# EAGLE design IOTERM (EAGLE 6.5.0)
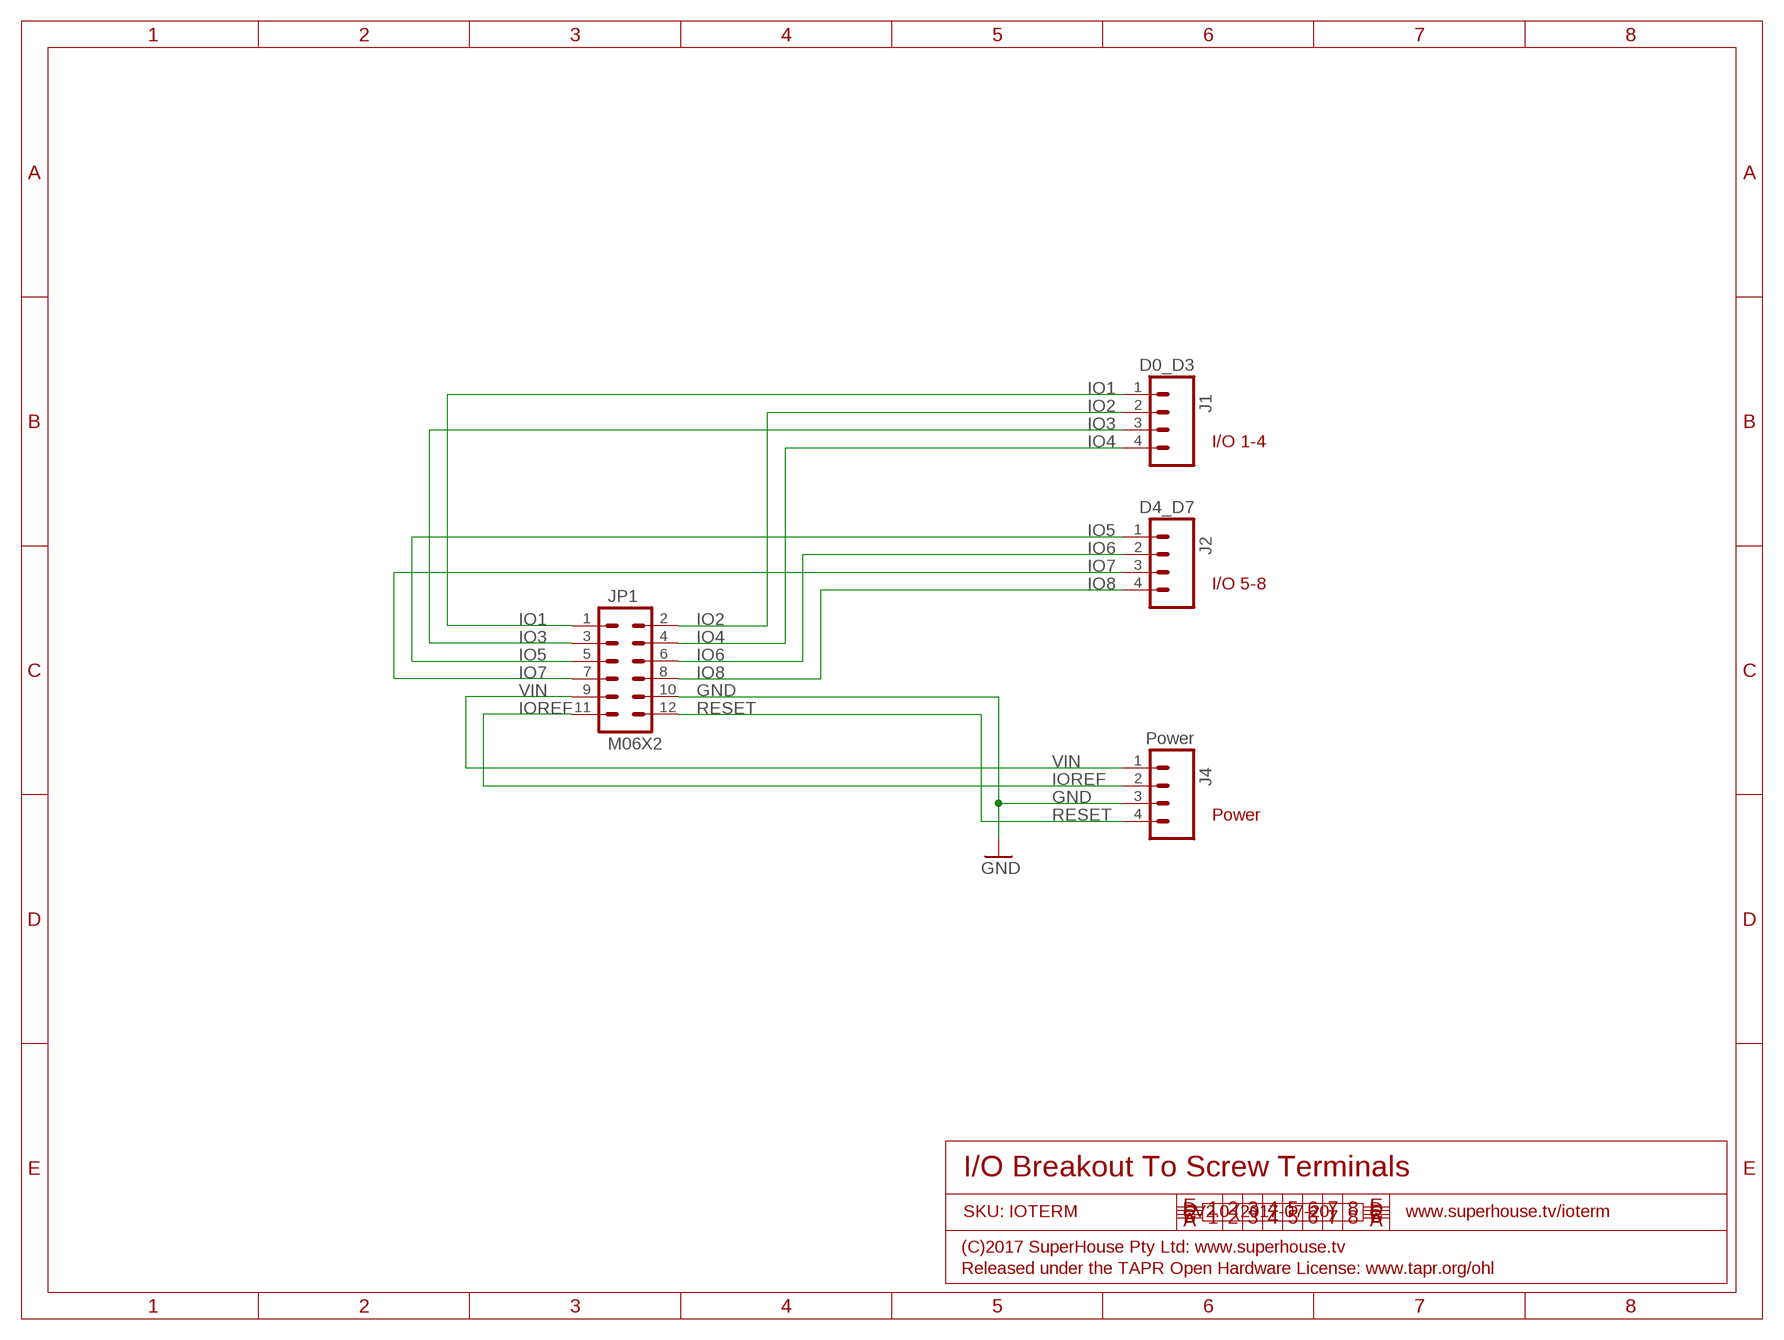
[diagram p0: schematic, sheet 1]

## Parts
J1  D0_D3  M04SCREW  [SCREWTERMINAL-3.5MM-4]
J2  D4_D7  M04SCREW  [SCREWTERMINAL-3.5MM-4]
J4  Power  M04SCREW  [SCREWTERMINAL-3.5MM-4]
JP1  M06X2  [2X6-SHROUDED]

## Nets
GND: J4.3 JP1.10
IO1: J1.1 JP1.1
IO2: J1.2 JP1.2
IO3: J1.3 JP1.3
IO4: J1.4 JP1.4
IO5: J2.1 JP1.5
IO6: J2.2 JP1.6
IO7: J2.3 JP1.7
IO8: J2.4 JP1.8
IOREF: J4.2 JP1.11
RESET: J4.4 JP1.12
VIN: J4.1 JP1.9

## Notes on the sheet
- I/O 1-4
- I/O 5-8
- Power
- I/O Breakout To Screw Terminals
- SKU: IOTERM | V2.0 (2017-07-20) | www.superhouse.tv/ioterm
- (C)2017 SuperHouse Pty Ltd: www.superhouse.tv
- Released under the TAPR Open Hardware License: www.tapr.org/ohl

## Library data of the parts
J1 J2 J4 = freetronics-master-v1.1:M04: Header 4 Standard 4-pin 0.1" header. Use with straight break away headers (SKU : PRT-00116), right angle break away headers (PRT-00553), swiss pins (PRT-00743), machine pins (PRT-00117), and female headers (PRT-00115). Molex polarized connector foot print use with SKU : PRT-08231 with associated crimp pins and housings.
JP1 = freetronics-jon:M06X2

## Board
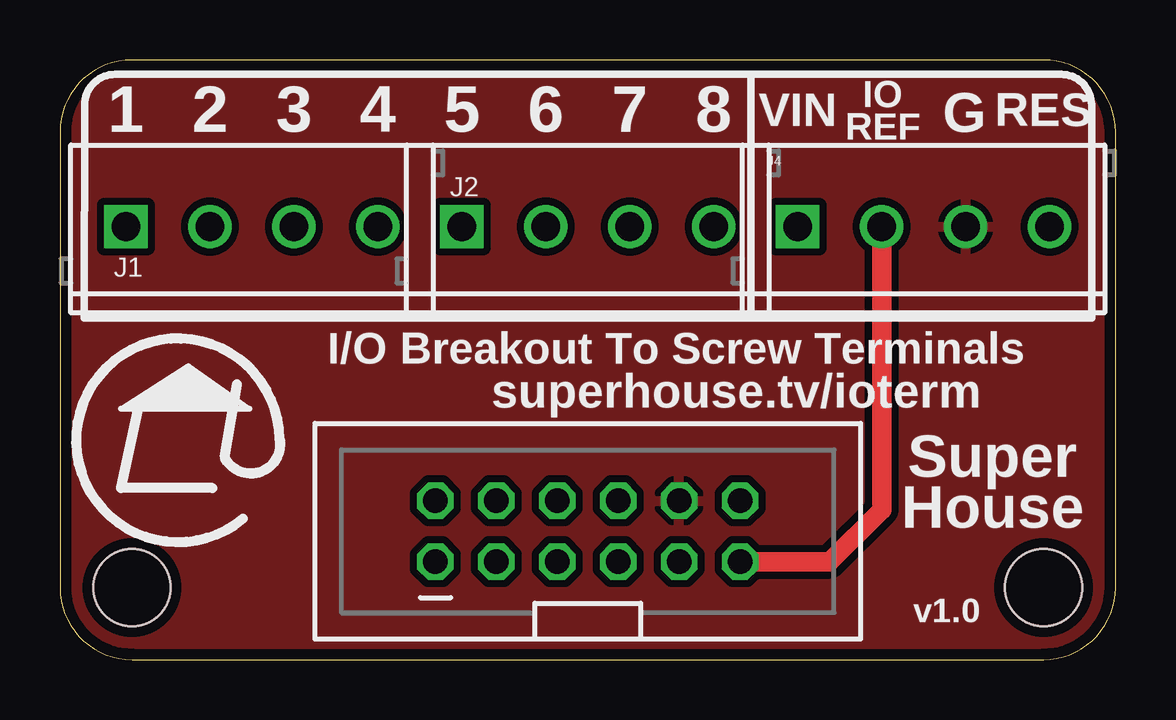
[diagram p1: board, top side]
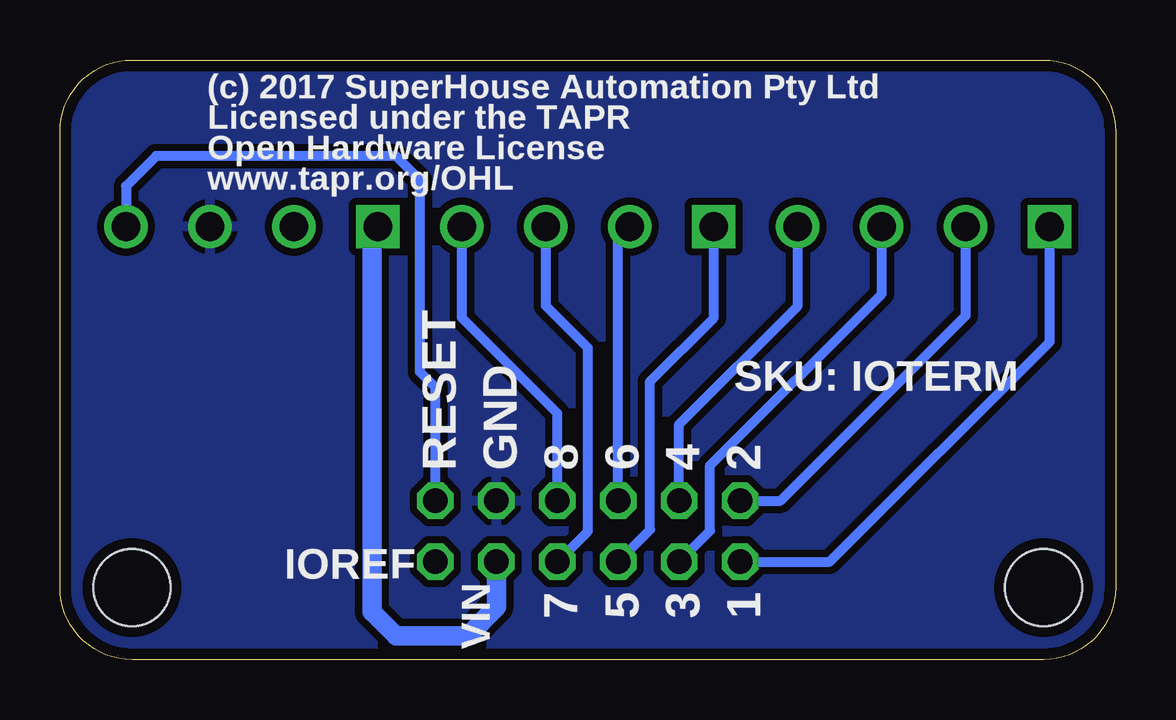
[diagram p2: board, bottom side, seen from below]

Size 44 x 25 mm. Coordinates in mm from the lower left corner, seen from the top.
Outline: 0,3 arc90 3,0 41,0 arc90 44,3 44,22 arc90 41,25 3,25 arc90 0,22 0,3
Copper layers (1*16): Top 0.035mm / dielectric 1.5mm / Bottom 0.035mm
Design rules "default *": minimum track width 10mil, minimum drill 24mil, track to track 12mil, track to pad 12mil, pad to pad 12mil, via to via 12mil, smd to smd 8mil, copper to edge 18mil, drill to drill 8mil, minimum pad ring 10mil, minimum via ring 8mil, stop-mask expansion 4mil, vias tented up to drill 25mil, thermal gap 10mil
Holes 3.2 mm at 41,3 3,3

### Footprints (pad centres in the part's own frame; a part is rotated, then mirrored left to right if it is on the bottom)
SCREWTERMINAL-3.5MM-4 = drill 1.2 square: 1 0,0 | drill 1.2: 2 3.5,0; 3 7,0; 4 10.5,0
2X6-SHROUDED = drill 1.016 octagon: 1 0,0; 2 2.54,0; 3 0,-2.54; 4 2.54,-2.54; 5 0,-5.08; 6 2.54,-5.08; 7 0,-7.62; 8 2.54,-7.62; 9 0,-10.16; 10 2.54,-10.16; 11 0,-12.7; 12 2.54,-12.7

### Placement (x,y rotation side)
J1  2.75,18.05 0 top
J2  16.75,18.05 0 top
J4  30.75,18.05 0 top
JP1  15.65,4.08 90 top

### Tracks (layer width: path | path; a pad name or v marks a point on that pad's centre or on a via)
GND
  pour Bottom: 0,22 arc-90 3,25 41,25 arc-90 44,22 44,3 arc-90 41,0 3,0 arc-90 0,3
  pour Top: 0,22 arc-90 3,25 41,25 arc-90 44,22 44,3 arc-90 41,0 3,0 arc-90 0,3
IO1
  Bottom 0.406: JP1.1 11.92,4.08 2.75,13.25 J1.1
IO2
  Bottom 0.406: JP1.2 13.97,6.62 6.25,14.34 J1.2
IO3
  Bottom 0.406: JP1.3 16.9,5.37 16.9,8.1 9.75,15.25 J1.3
IO4
  Bottom 0.406: JP1.4 18.19,9.81 13.25,14.75 J1.4
IO5
  Bottom 0.406: JP1.5 19.4,5.41 19.4,11.6 16.75,14.25 J2.1
IO6
  Bottom 0.406: JP1.6 20.73,17.57 J2.2
IO7
  Bottom 0.406: JP1.7 22,5.35 22,13 23.75,14.75 J2.3
IO8
  Bottom 0.406: JP1.8 23.27,10.27 27.25,14.25 J2.4
IOREF
  Top 0.813: JP1.11 32.08,4.08 34.25,6.25 J4.2
RESET
  Bottom 0.406: JP1.12 28.35,11.35 29,12 29,20 30,21 40,21 41.25,19.75 J4.4
VIN
  Bottom 0.813: JP1.9 25.81,2.19 27,1 30,1 31,2 31,17.8 J4.1

### Text on the board
tPlace: 1 | 2 | 3 | 4 | 5 | 6 | 7 | 8 | VIN | IO / REF | G | RES | I/O Breakout To Screw Terminals | superhouse.tv/ioterm | Super / House | v1.0
bPlace: (c) 2017 SuperHouse Automation Pty Ltd | Licensed under the TAPR | Open Hardware License | www.tapr.org/OHL | SKU: IOTERM | 2 | 4 | 6 | 8 | GND | RESET | IOREF | 1 | 3 | 5 | 7 | VIN
tValues: 100nF